# EAGLE design Stepper2Laser (EAGLE 8.2.2)
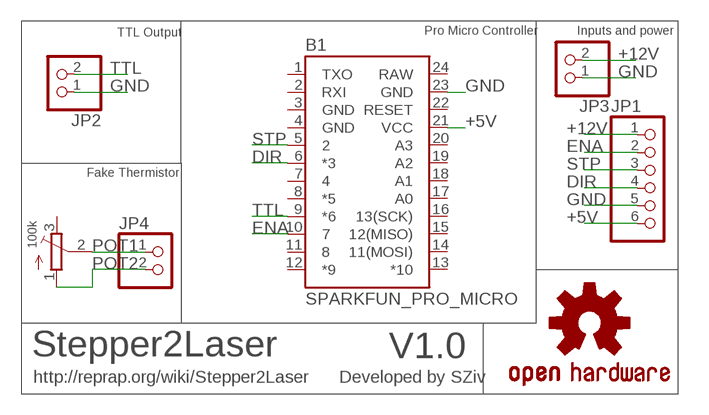
[diagram p0: schematic, sheet 1]

## Parts
B1  SPARKFUN_PRO_MICRO  [SPARKFUN_PRO_MICRO]
JP1  PINHD-1X6  [1X06]
JP2  PINHD-1X2  [1X02]
JP3  PINHD-1X2  [1X02]
JP4  PINHD-1X2  [1X02]
LOGO1  OSHW-LOGOMINI  [OSHW-LOGO-MINI]
TM1  TRIMPOT3386  [TRIM-3386]

## Nets
+5V: B1.21(VCC) JP1.6
+12V: JP1.1 JP3.2
DIR: B1.6(*3) JP1.4
ENA: B1.10 JP1.2
GND: B1.23(GND) JP1.5 JP2.1 JP3.1
POT1: JP4.1 TM1.2(S)
POT2: JP4.2 TM1.1(A)
STP: B1.5 JP1.3
TTL: B1.9(*6) JP2.2
Unconnected: B1.1(TXO) B1.2(RXI) B1.7 B1.8(*5) B1.11 B1.12(*9) B1.13(*10) B1.14(11(MOSI)) B1.15(12(MISO)) B1.16(13(SCK)) B1.17(A0) B1.18(A1) B1.19(A2) B1.20(A3) B1.22(RESET) TM1.3(E)

## Notes on the sheet
- TTL Output | Pro Micro Controller | Inputs and power
- Fake Thermistor
- 100k
- Stepper2Laser | V1.0
- http://reprap.org/wiki/Stepper2Laser | Developed by SZiv

## Power pins joined to a net without a drawn wire
GND: B1.3(GND) B1.4(GND)
RAW: B1.24(RAW)

## Library data of the parts
B1 = SparkFun-Boards:SPARKFUN_PRO_MICRO: SparkFun Pro Micro Atmega32U4 compatible footprint. SparkFun Products: 3.3V/8MHz <https://www.sparkfun.com/products/12587> 5V/16MHz <https://www.sparkfun.com/products/12640>
JP1 = adafruit:PINHD-1X6: PIN HEADER
JP2-JP4 = pinhead:PINHD-1X2: PIN HEADER
LOGO1 = SparkFun-Aesthetics:OSHW-LOGO: Open-Source Hardware (OSHW) Logo This logo indicates the piece of hardware it is found on incorporates a OSHW license and/or adheres to the definition of open source hardware found here: http://freedomdefined.org/OSHW
TM1 = adafruit:TRIMPOT: SMT trimmer potentiometer part number TC33X http://www.ladyada.net/library/eagle

## Board
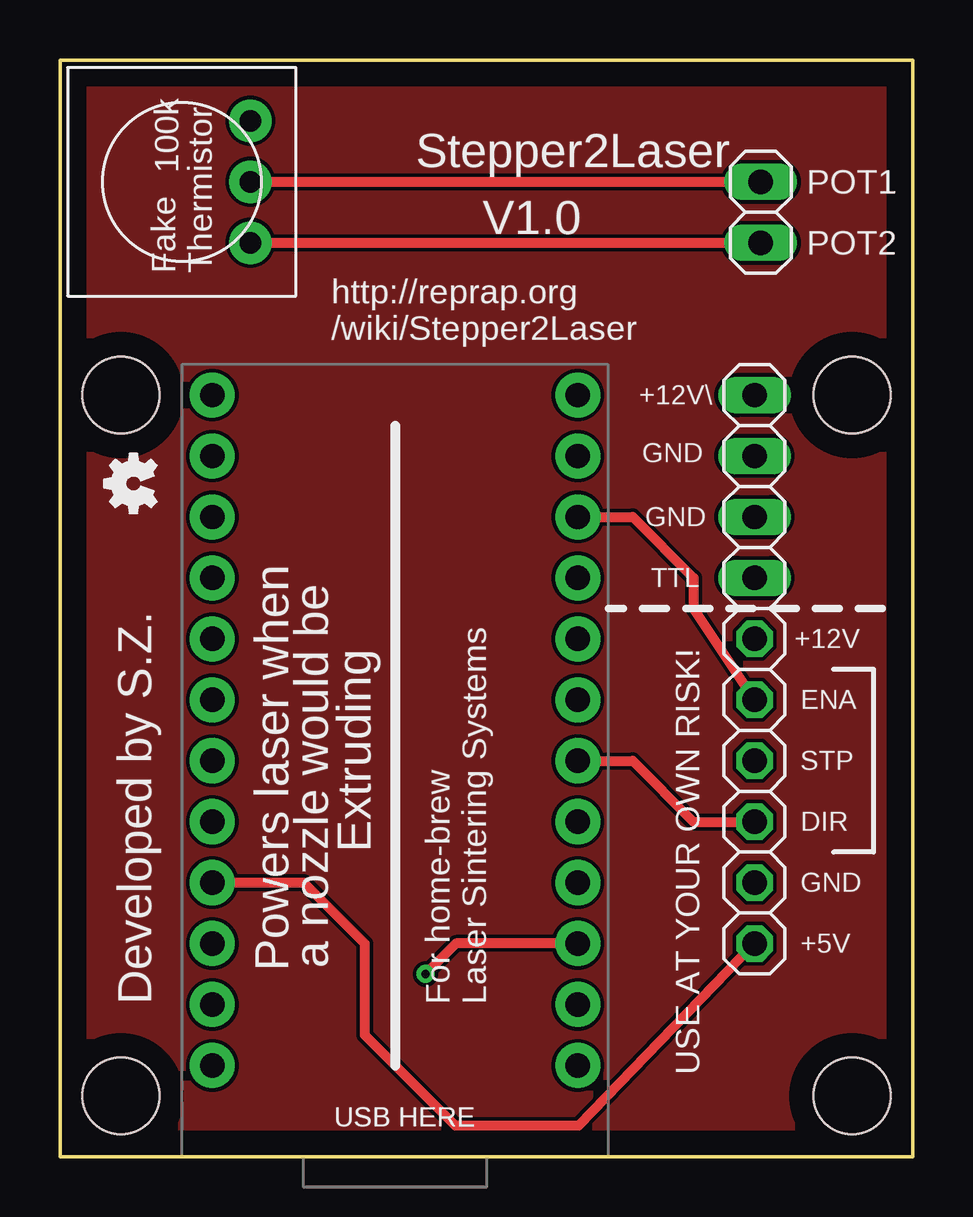
[diagram p1: board, top side]
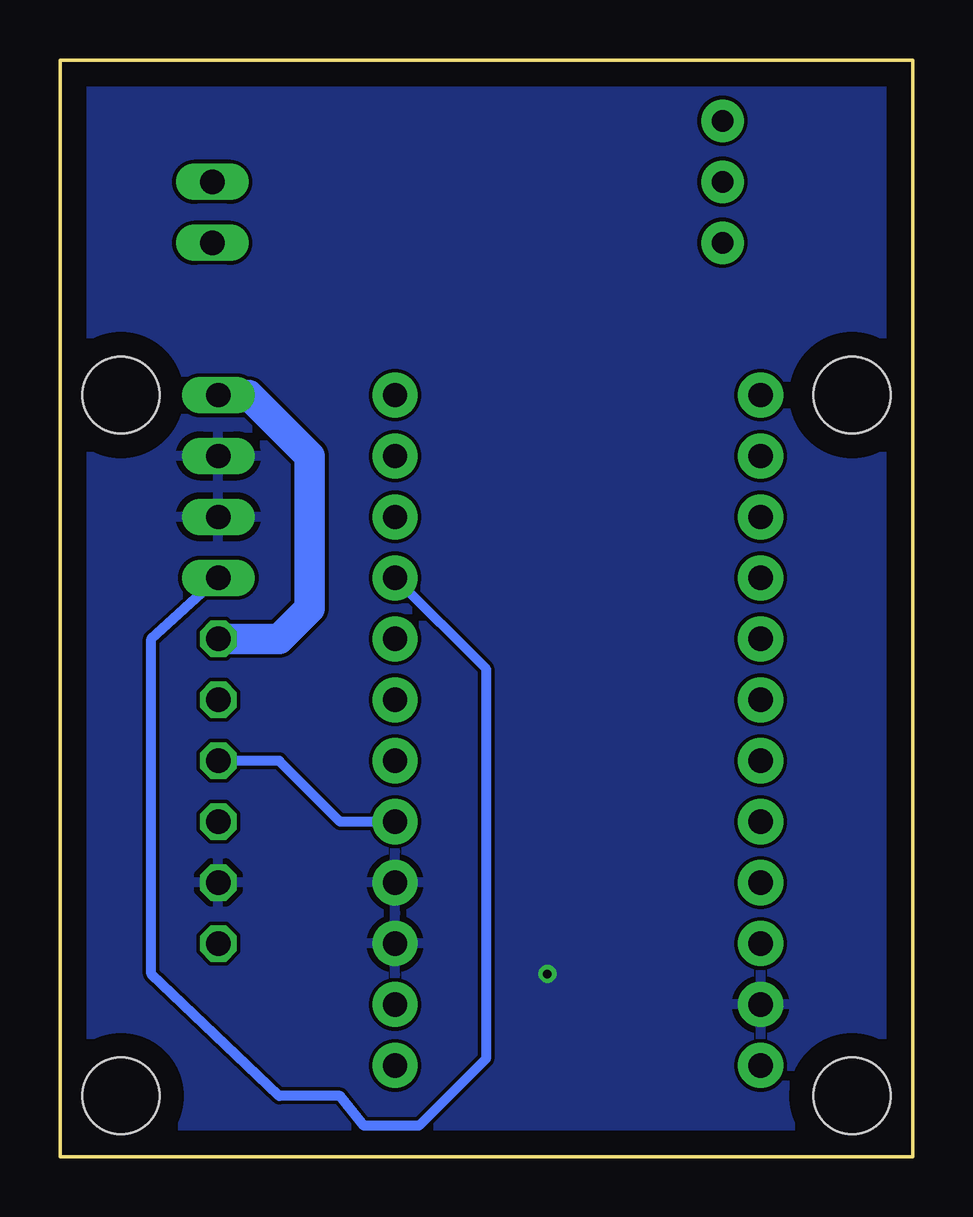
[diagram p2: board, bottom side, seen from below]

Size 35.56 x 45.72 mm. Coordinates in mm from the lower left corner, seen from the top.
Outline: 0,0 35.56,0 35.56,45.72 0,45.72 0,0
Copper layers (1*16): Top 0.035mm / dielectric 1.5mm / Bottom 0.035mm
Design rules "default": minimum track width 6mil, minimum drill 0.35mm, track to track 6mil, track to pad 6mil, pad to pad 6mil, via to via 6mil, smd to smd 6mil, copper to edge 40mil, drill to drill 6mil, minimum pad ring 10mil, minimum via ring 8mil, stop-mask expansion 4mil, vias tented up to drill 0mil, thermal gap 10mil
Holes 3.2 mm at 2.54,2.54 2.54,31.75 33.02,31.75 33.02,2.54

### Footprints (pad centres in the part's own frame; a part is rotated, then mirrored left to right if it is on the bottom)
SPARKFUN_PRO_MICRO = drill 1.016 pad 1.88: 1 -7.62,12.7; 2 -7.62,10.16; 3 -7.62,7.62; 4 -7.62,5.08; 5 -7.62,2.54; 6 -7.62,0; 7 -7.62,-2.54; 8 -7.62,-5.08; 9 -7.62,-7.62; 10 -7.62,-10.16; 11 -7.62,-12.7; 12 -7.62,-15.24; 13 7.62,-15.24; 14 7.62,-12.7; 15 7.62,-10.16; 16 7.62,-7.62; 17 7.62,-5.08; 18 7.62,-2.54; 19 7.62,0; 20 7.62,2.54; 21 7.62,5.08; 22 7.62,7.62; 23 7.62,10.16; 24 7.62,12.7
1X06 = drill 1.016 octagon: 1 -6.35,0; 2 -3.81,0; 3 -1.27,0; 4 1.27,0; 5 3.81,0; 6 6.35,0
1X02 = drill 1.016 long: 1 -1.27,0; 2 1.27,0
TRIM-3386 = drill 0.9 pad 1.778: 1 -2.54,-2.857; 2 0,-2.857; 3 2.54,-2.857

### Placement (x,y rotation side)
B1  13.97,16.51 180 top
JP1  28.96,15.24 270 top
JP2  28.96,25.4 270 top
JP3  28.96,30.48 90 top
JP4  29.21,39.37 270 top
LOGO1  3.05,28.07 90 top
TM1  5.08,40.64 90 top

### Tracks (layer width: path | path; a pad name or v marks a point on that pad's centre or on a via)
+5V
  Top 0.406: B1.21 10.16,11.43 12.7,8.89 12.7,5.08 16.48,1.29 21.61,1.29 JP1.6
+12V
  Bottom 1.27: JP3.2 27.69,31.75 25.15,29.21 25.15,22.86 26.42,21.59 JP1.1
DIR
  Top 0.406: B1.6 23.88,16.51 26.42,13.97 JP1.4
ENA
  Top 0.406: B1.10 23.88,26.67 26.42,24.13 26.42,22.86 JP1.2
GND  (via drill 0.35)
  Top 0.406: B1.3 16.51,8.89 v15.24,7.62
  pour Bottom: 0,45.72 35.56,45.72 35.56,0 0,0
N$1
  pour Top: 0,45.72 35.56,45.72 35.56,0 0,0
POT1
  Top 0.406: TM1.2 JP4.1
POT2
  Top 0.406: TM1.1 JP4.2
STP
  Bottom 0.406: B1.5 23.88,13.97 26.42,16.51 JP1.3
TTL
  Bottom 0.406: B1.9 17.8,20.34 17.8,4.08 20.59,1.29 22.89,1.29 23.88,2.54 26.42,2.54 31.75,7.62 31.75,21.59 JP2.2

### Text on the board
tPlace: Stepper2Laser | 100k | V1.0 | POT1 | POT2 | Fake / Thermistor | http://reprap.org / /wiki/Stepper2Laser | +12V\ | GND | GND | TTL | +12V | ENA | STP | DIR | Extruding | GND | +5V | Powers laser when | a nozzle would be | Developed by S.Z. | For home-brew / Laser Sintering Systems | USE AT YOUR OWN RISK! | USB HERE | USB HERE